# EAGLE design PCB-VU3 (EAGLE 6.4)
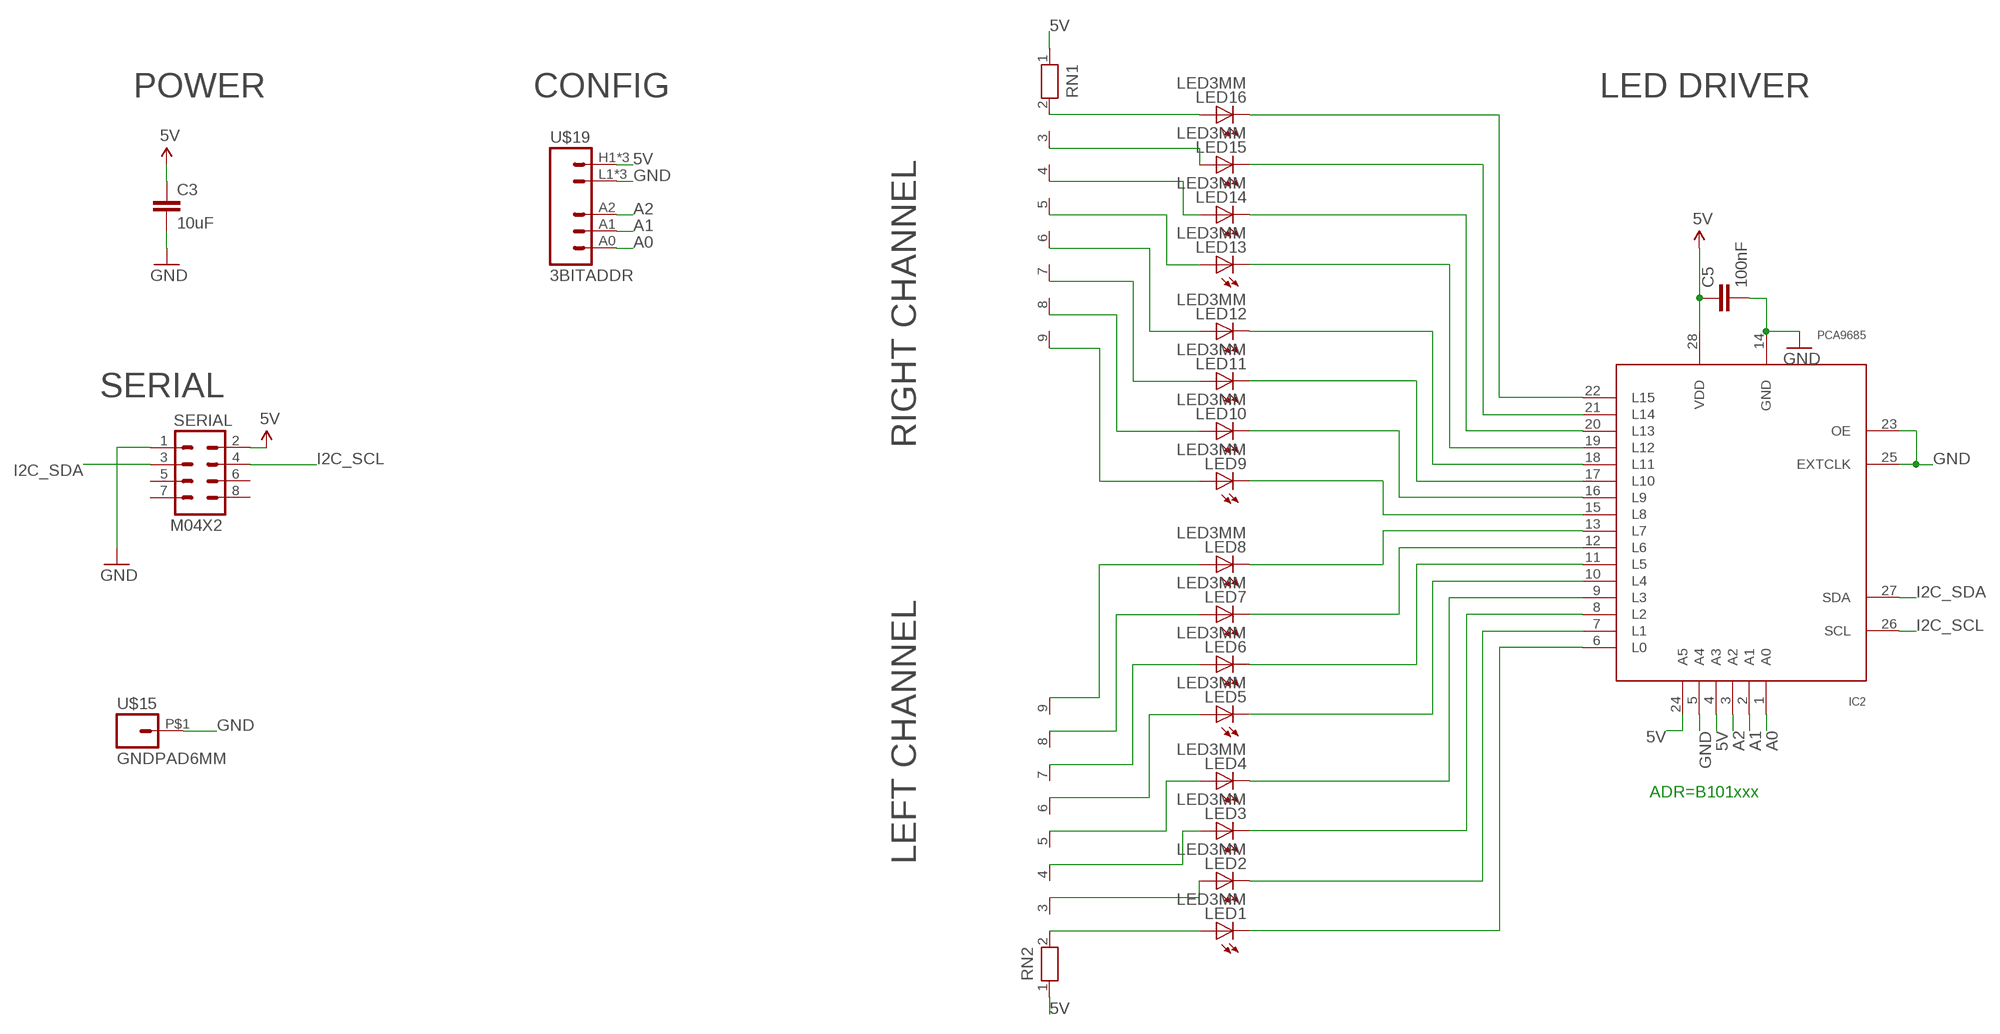
[diagram p0: schematic, sheet 1]

## Parts
C3  10uF  CAP0805  [0805]
C5  100nF  CAP0603-CAP  [0603-CAP]
IC2  PCA9685  [TSSOP28]
LED1  LED3MM  [LED3MM]
LED2  LED3MM  [LED3MM]
LED3  LED3MM  [LED3MM]
LED4  LED3MM  [LED3MM]
LED5  LED3MM  [LED3MM]
LED6  LED3MM  [LED3MM]
LED7  LED3MM  [LED3MM]
LED8  LED3MM  [LED3MM]
LED9  LED3MM  [LED3MM]
LED10  LED3MM  [LED3MM]
LED11  LED3MM  [LED3MM]
LED12  LED3MM  [LED3MM]
LED13  LED3MM  [LED3MM]
LED14  LED3MM  [LED3MM]
LED15  LED3MM  [LED3MM]
LED16  LED3MM  [LED3MM]
RN1  RN08  [RN-9]
RN2  RN08  [RN-9]
SERIAL  M04X2  [2X4]
U$15  GNDPAD6MM  [3.2MMPAD6MM]
U$19  3BITADDR  [3BITADDR]

## Nets
5V [Power]: C3.1 C5.1 IC2.4(A3) IC2.24(A5) IC2.28(VDD) RN1.1 RN2.1 SERIAL.2 U$19.H1(VCC) U$19.H2(VCC) U$19.H3(VCC)
A0: IC2.1(A0) U$19.A0
A1: IC2.2(A1) U$19.A1
A2: IC2.3(A2) U$19.A2
GND [Power]: C3.2 C5.2 IC2.5(A4) IC2.14(GND) IC2.23(OE) IC2.25(EXTCLK) SERIAL.1 U$15.P$1 U$19.L1(GND) U$19.L2(GND) U$19.L3(GND)
I2C_SCL: IC2.26(SCL) SERIAL.4
I2C_SDA: IC2.27(SDA) SERIAL.3
N$1: IC2.13(L7) LED8.K(C)
N$2: LED16.A RN1.2
N$3: LED15.A RN1.3
N$4: LED14.A RN1.4
N$5: LED13.A RN1.5
N$6: LED12.A RN1.6
N$7: LED11.A RN1.7
N$8: LED10.A RN1.8
N$9: LED9.A RN1.9
N$10: LED1.A RN2.2
N$11: LED2.A RN2.3
N$12: LED3.A RN2.4
N$13: LED4.A RN2.5
N$14: LED5.A RN2.6
N$15: LED6.A RN2.7
N$16: IC2.12(L6) LED7.K(C)
N$17: IC2.11(L5) LED6.K(C)
N$18: IC2.10(L4) LED5.K(C)
N$19: IC2.9(L3) LED4.K(C)
N$20: IC2.8(L2) LED3.K(C)
N$21: IC2.7(L1) LED2.K(C)
N$22: IC2.6(L0) LED1.K(C)
N$23: IC2.15(L8) LED9.K(C)
N$24: IC2.16(L9) LED10.K(C)
N$25: IC2.17(L10) LED11.K(C)
N$26: IC2.18(L11) LED12.K(C)
N$27: IC2.19(L12) LED13.K(C)
N$28: IC2.20(L13) LED14.K(C)
N$29: IC2.21(L14) LED15.K(C)
N$30: IC2.22(L15) LED16.K(C)
N$31: LED7.A RN2.8
N$32: LED8.A RN2.9
Unconnected: SERIAL.5 SERIAL.6 SERIAL.7 SERIAL.8

## Notes on the sheet
- POWER | CONFIG | LED DRIVER
- SERIAL
- RIGHT CHANNEL
- ADR=B101xxx
- LEFT CHANNEL

## Library data of the parts
C3 C5 = SparkFun:CAP: Capacitor Standard 0603 ceramic capacitor, and 0.1" leaded capacitor.
IC2 = wsmith:PCA9685
LED1-LED16 = SKAARHOJ:LED: KINGBRIGHT 20MM BIG LAMP
RN1 RN2 = SKAARHOJ:RN08: RESISTOR NETWORK; OC_FARNELL: unknown; OC_NEWARK: unknown
SERIAL = SparkFun:M04X2
U$15 = SKAARHOJ:GNDPAD
U$19 = SKAARHOJ:3BITADDR

## Net classes
0 default: width 0.203 mm, drill 0.406 mm, clearance 0.152 mm
1 Power: width 0.406 mm, drill 0.61 mm, clearance 0.203 mm
2 Signal: width 0.152 mm, clearance 0.152 mm

## Board
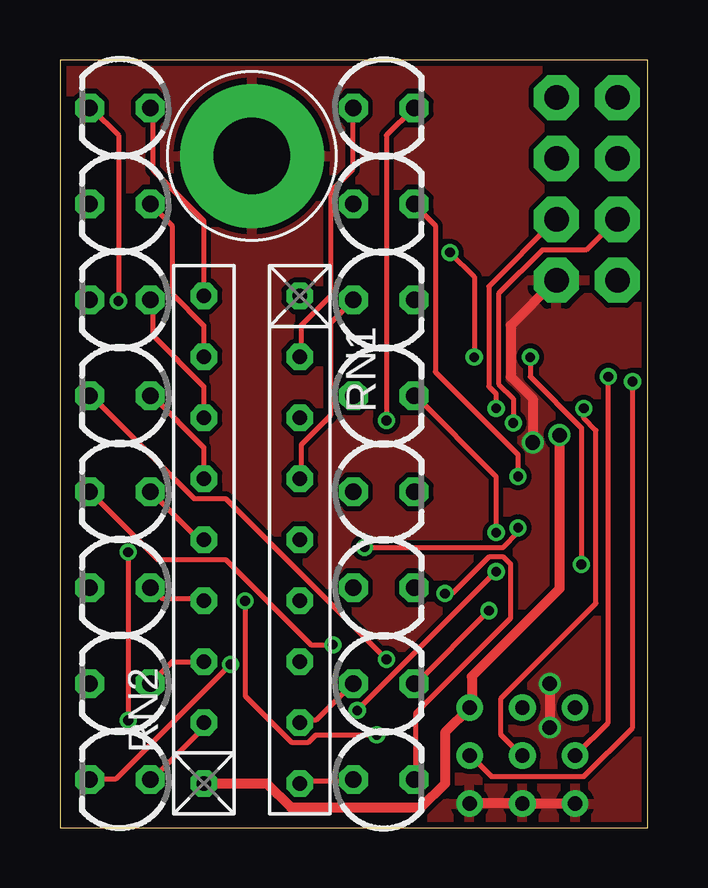
[diagram p1: board, top side]
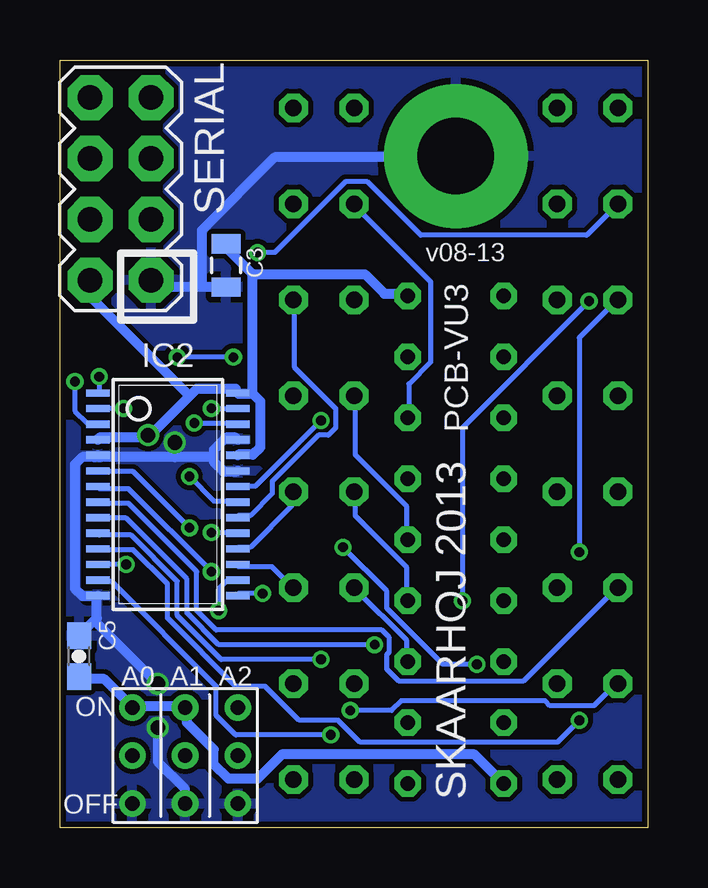
[diagram p2: board, bottom side, seen from below]

Size 24.5 x 32 mm. Coordinates in mm from the lower left corner, seen from the top.
Outline: 0,0 24.5,0 24.5,32 0,32 0,0
Copper layers (1*16): Top 0.035mm / dielectric 1.5mm / Bottom 0.035mm
Design rules "Fusion_eagle_rule_v1.1": minimum track width 6mil, minimum drill 12mil, track to track 6mil, track to pad 6mil, pad to pad 6mil, via to via 6mil, smd to smd 0mil, copper to edge 10mil, drill to drill 10mil, minimum pad ring 10mil, minimum via ring 6mil, stop-mask expansion 2mil, vias tented up to drill 100mil, thermal gap 10mil

### Footprints (pad centres in the part's own frame; a part is rotated, then mirrored left to right if it is on the bottom)
0805 = smd 0.8 x 1.2: 1 -0.9,0; 2 0.9,0
0603-CAP = smd 1.1 x 1: 1 -0.85,0; 2 0.85,0
TSSOP28 = smd 0.305 x 0.991: 1 -4.225,-2.918; 2 -3.575,-2.918; 3 -2.925,-2.918; 4 -2.275,-2.918; 5 -1.625,-2.918; 6 -0.975,-2.918; 7 -0.325,-2.918; 8 0.325,-2.918; 9 0.975,-2.918; 10 1.625,-2.918; 11 2.275,-2.918; 12 2.925,-2.918; 13 3.575,-2.918; 14 4.225,-2.918; 15 4.225,2.918; 16 3.575,2.918; 17 2.925,2.918; 18 2.275,2.918; 19 1.625,2.918; 20 0.975,2.918; 21 0.325,2.918; 22 -0.325,2.918; 23 -0.975,2.918; 24 -1.625,2.918; 25 -2.275,2.918; 26 -2.925,2.918; 27 -3.575,2.918; 28 -4.225,2.918
LED3MM = drill 0.7 pad 1.2 octagon: A -1.27,0; K 1.27,0
RN-9 = drill 0.6 octagon: 1 -10.16,0; 2 -7.62,0; 3 -5.08,0; 4 -2.54,0; 5 0,0; 6 2.54,0; 7 5.08,0; 8 7.62,0; 9 10.16,0
2X4 = drill 1.016 pad 1.88 octagon: 1 -3.81,-1.27; 2 -3.81,1.27; 3 -1.27,-1.27; 4 -1.27,1.27; 5 1.27,-1.27; 6 1.27,1.27; 7 3.81,-1.27; 8 3.81,1.27
3.2MMPAD6MM = drill 3.2 pad 6: P$1 0,0
3BITADDR = drill 0.6: A0 -2.2,0; A1 0,0; A2 2.2,0; H1 -2.2,2; H2 0,2; H3 2.2,2; L1 -2.2,-2; L2 0,-2; L3 2.2,-2

### Placement (x,y rotation side)
C3  17.57,23.43 270 bottom
C5  23.7,7.14 90 bottom
IC2  20,13.89 270 bottom
LED1  2.5,2 180 top
LED2  2.5,6 180 top
LED3  2.5,10 180 top
LED4  2.5,14 180 top
LED5  2.5,18 180 top
LED6  2.5,22 180 top
LED7  2.5,26 180 top
LED8  2.5,30 180 top
LED9  13.5,2 0 top
LED10  13.5,6 0 top
LED11  13.5,10 0 top
LED12  13.5,14 0 top
LED13  13.5,18 0 top
LED14  13.5,22 0 top
LED15  13.5,26 0 top
LED16  13.5,30 0 top
RN1  10,12 270 top
RN2  6,12 90 top
SERIAL  21.98,26.62 90 bottom
U$15  8,28 0 top
U$19  19.28,3 0 bottom

### Tracks (layer width: path | path; a pad name or v marks a point on that pad's centre or on a via)
5V  (via drill 0.61)
  Top 0.406: RN2.1 6.1,1.83 8.64,1.83 9.65,0.81 15.04,0.81 16.05,1.83 16.05,3.96 17.07,4.98 U$19.H3 17.17,5.18 17.17,6.3 20.83,9.96 v20.83,16.36
  Bottom 0.406: C5.1 23.67,6.2 22.66,6.2 21.54,5.08 U$19.H1 21.34,5.08 19.3,5.08 U$19.H2 19.2,4.88 19.2,4.37 18.09,3.25 18.09,2.64 17.48,2.03 16.26,2.03 15.24,3.05 7.21,3.05 6.1,1.93 RN2.1 | 16.46,18.09 16.15,17.78 16.15,15.85 16.46,15.54 17.07,15.54 IC2.24 | 16.46,18.09 17.07,18.09 IC2.28 17.17,18.29 18.8,18.29 19.1,17.98 | 20.83,16.26 22.86,16.26 IC2.4 | 19.1,17.98 20.83,16.26 | 16.46,23.06 17.48,24.08 17.48,24.28 C3.1 | 16.46,18.09 16.46,23.06 | 16.46,23.06 11.79,23.06 10.97,22.25 10.06,22.25 RN1.1 | 19.1,17.98 23.16,22.05 23.16,22.76 SERIAL.2 | v20.83,16.36 20.83,16.26
A0  (via drill 0.41)
  Top 0.203: v22.86,18.8 22.86,4.37 21.54,3.05 U$19.A0
  Bottom 0.203: v22.86,18.8 22.86,18.19 IC2.1
A1  (via drill 0.41)
  Top 0.203: v21.84,17.48 21.84,17.07 22.35,16.56 22.35,9.35 18.39,5.38 18.39,3.86 19.2,3.05 U$19.A1
  Bottom 0.203: v21.84,17.48 22.86,17.48 IC2.2
A2  (via drill 0.41)
  Top 0.203: v23.88,18.59 23.88,4.17 21.84,2.13 17.98,2.13 17.17,2.95 U$19.A2
  Bottom 0.203: v23.88,18.59 23.88,17.37 23.37,16.87 22.96,16.87 IC2.3
GND  (via drill 0.61)
  Top 0.406: U$19.L3 17.17,1.02 19.2,1.02 U$19.L2 19.41,1.02 21.44,1.02 U$19.L1 | v20.42,5.99 v20.42,4.17 | v19.71,16.05 19.71,17.88 18.8,18.8 18.8,20.93 20.62,22.76 SERIAL.1
  Bottom 0.406: 23.06,8.64 23.67,8.03 C5.2 | 23.06,8.64 22.96,8.74 22.96,9.65 IC2.14 23.16,9.65 23.57,9.65 23.88,9.96 23.88,15.14 23.57,15.44 23.06,15.44 IC2.5 22.86,15.44 19.71,15.44 | 18.09,15.44 18.09,15.75 17.58,16.26 17.17,16.26 IC2.25 | 18.09,15.44 18.09,15.24 17.68,14.83 17.17,14.83 IC2.23 | 18.09,15.44 19.71,15.44 | v20.42,4.17 20.42,2.74 19.3,1.63 19.3,1.02 U$19.L2 | 23.06,8.64 v20.42,5.99 | 18.59,22.55 20.42,22.55 20.62,22.76 SERIAL.1 | 18.59,22.55 17.58,22.55 C3.2 | 18.59,22.55 18.59,24.89 15.54,27.94 8.03,27.94 U$15.P$1 | v19.71,16.05 19.71,15.44
  pour Top: 0,0 25,0 25,32 0,32
  pour Bottom: 0,0 25,0 25,32 0,32
I2C_SCL  (via drill 0.41)
  Top 0.203: v18.9,16.87 18.9,17.88 18.29,18.49 18.29,22.25 20.12,24.08 21.95,24.08 23.16,25.3 SERIAL.4
  Bottom 0.203: v18.9,16.87 17.17,16.87 IC2.26
I2C_SDA  (via drill 0.41)
  Top 0.203: v18.19,17.48 18.19,18.09 17.88,18.39 17.88,22.55 20.62,25.3 SERIAL.3
  Bottom 0.203: v18.19,17.48 17.17,17.48 IC2.27
N$1  (via drill 0.41)
  Top 0.203: v13.21,3.86 10.67,3.86 10.36,3.56 9.65,3.56 7.72,5.49 v7.72,9.45 | v2.44,21.95 2.44,28.85 1.32,29.97 LED8.K
  Bottom 0.203: v13.21,3.86 17.17,3.86 17.98,4.67 17.98,5.89 22.35,10.26 22.86,10.26 IC2.13 | v7.72,9.45 7.72,16.66 v2.44,21.95
N$2
  Top 0.203: RN1.2 10.06,19.71 10.06,20.93 11.28,22.15 11.28,26.52 12.19,27.43 12.19,29.97 LED16.A
N$3
  Bottom 0.203: RN1.3 9.96,17.17 9.96,18.49 9.04,19.41 9.04,22.76 12.19,25.91 LED15.A
N$4
  Top 0.203: RN1.4 10.06,14.63 10.06,15.95 11.28,17.17 11.28,21.03 12.19,21.95 LED14.A
N$5
  Bottom 0.203: RN1.5 10.06,12.09 10.06,13.41 12.19,15.54 12.19,17.98 LED13.A
N$6
  Bottom 0.203: RN1.6 10.06,9.55 10.06,10.87 12.19,13.01 12.19,13.92 LED12.A
N$7
  Bottom 0.203: RN1.7 10.06,7.01 10.06,7.82 12.19,9.96 LED11.A
N$8
  Top 0.203: RN1.8 10.06,4.47 10.67,4.47 12.19,5.99 LED10.A
N$9
  Top 0.203: RN1.9 10.06,1.93 12.19,1.93 LED9.A
N$10
  Top 0.203: RN2.2 5.99,4.17 3.86,2.03 LED1.A
N$11
  Top 0.203: RN2.3 4.67,6.91 3.86,6.1 LED2.A
N$12
  Top 0.203: RN2.4 5.99,9.55 4.27,9.55 3.86,9.96 LED3.A
N$13
  Top 0.203: RN2.5 5.99,12.09 5.69,12.09 3.86,13.92 LED4.A
N$14
  Top 0.203: RN2.6 5.99,14.63 5.99,15.85 3.86,17.98 LED5.A
N$15
  Top 0.203: RN2.7 5.99,17.17 5.99,18.39 3.86,20.52 3.86,21.95 LED6.A
N$16  (via drill 0.41)
  Top 0.203: v21.74,10.97 21.74,16.66 19.61,18.8 v19.61,19.61 | v17.27,19.61 17.27,22.96 v16.26,23.98
  Bottom 0.203: v21.74,10.97 22.86,10.97 IC2.12 | v17.27,19.61 v19.61,19.61 | v16.26,23.98 15.54,23.98 12.6,26.92 11.68,26.92 9.45,24.69 2.54,24.69 1.32,25.91 LED7.K
N$17  (via drill 0.41)
  Top 0.203: v2.85,11.48 v2.85,4.47
  Bottom 0.203: v2.85,4.47 3.76,3.56 11.99,3.56 12.9,4.47 14.53,4.47 15.95,5.89 17.17,5.89 20.02,8.74 20.02,10.16 21.44,11.58 22.86,11.58 IC2.11 | v2.85,11.48 2.85,20.42 1.32,21.95 LED6.K
N$18  (via drill 0.41)
  Top 0.203: v13.61,7.01 6.91,13.72 5.59,13.72 1.32,17.98 LED5.K
  Bottom 0.203: v13.61,7.01 17.78,7.01 19.61,8.84 19.61,10.26 21.54,12.19 22.86,12.19 IC2.10
N$19  (via drill 0.41)
  Top 0.203: v11.38,7.62 10.46,7.62 6.91,11.18 4.06,11.18 1.32,13.92 LED4.K
  Bottom 0.203: v11.38,7.62 17.88,7.62 19.2,8.94 19.2,10.36 21.74,12.9 22.86,12.9 IC2.9
N$20
  Bottom 0.203: IC2.8 22.86,13.51 21.64,13.51 18.8,10.67 18.8,9.04 17.98,8.23 11.07,8.23 10.77,7.92 10.77,7.32 10.87,7.21 10.87,6.6 10.36,6.1 5.18,6.1 1.32,9.96 LED3.K
N$21  (via drill 0.41)
  Top 0.203: v12.39,4.88 v18.19,10.67
  Bottom 0.203: v18.19,10.67 21.64,14.12 22.86,14.12 IC2.7 | v12.39,4.88 10.67,4.88 10.26,5.28 4.27,5.28 4.06,5.08 2.23,5.08 1.32,5.99 LED2.K
N$22  (via drill 0.41)
  Top 0.203: v19.1,12.5 19.1,12.29 18.49,11.68 v12.7,11.68 | v7.11,6.81 2.34,2.03 1.32,2.03 LED1.K
  Bottom 0.203: v19.1,12.5 21.44,14.83 22.86,14.83 IC2.6 | v12.7,11.68 10.87,9.86 10.87,9.14 8.53,6.81 v7.11,6.81
N$23  (via drill 0.41)
  Top 0.203: v16.05,9.75 16.36,9.75 17.88,11.28 18.49,11.28 18.8,10.97 18.8,8.74 14.83,4.78 14.83,2.03 LED9.K
  Bottom 0.203: v16.05,9.75 17.07,9.75 IC2.15
N$24  (via drill 0.41)
  Top 0.203: v17.88,9.04 14.83,5.99 LED10.K
  Bottom 0.203: v17.88,9.04 17.88,9.96 17.58,10.26 17.17,10.26 IC2.16
N$25
  Bottom 0.203: IC2.17 17.07,10.87 15.65,10.87 14.83,10.06 LED11.K
N$26
  Bottom 0.203: IC2.18 17.07,11.68 16.56,11.68 14.83,13.41 14.83,13.92 LED12.K
N$27  (via drill 0.41)
  Top 0.203: v18.19,12.29 18.19,14.63 14.83,17.98 LED13.K
  Bottom 0.203: v18.19,12.29 17.17,12.29 IC2.19
N$28
  Bottom 0.203: IC2.20 17.07,13.01 16.56,13.01 15.65,13.92 15.65,14.43 13.72,16.36 13.31,16.36 13.01,16.66 13.01,17.48 14.73,19.2 14.73,21.95 LED14.K
N$29  (via drill 0.41)
  Top 0.203: v19.1,14.63 19.1,15.54 15.65,19 15.65,25.09 14.83,25.91 LED15.K
  Bottom 0.203: v19.1,14.63 18.09,13.61 17.17,13.61 IC2.21
N$30  (via drill 0.41)
  Top 0.203: v13.61,16.97 13.61,28.85 14.73,29.97 LED16.K
  Bottom 0.203: v13.61,16.97 16.36,14.22 17.07,14.22 IC2.22
N$31
  Top 0.203: RN2.8 5.99,19.71 5.99,20.93 4.67,22.25 4.67,25.09 3.86,25.91 LED7.A
N$32
  Top 0.203: RN2.9 5.99,22.25 5.99,25.3 3.86,27.43 3.86,29.97 LED8.A

### Text on the board
_bsilk: v08-13 | PCB-VU3 | SKAARHOJ 2013